# Altium schematic sheet BSPD_System.SchDoc: QUTMS Shutdown V2 - BSPD_System
size A4; Author: Jonn Dillon; Organization: QUT Motorsport; Address1: O-120; Address2: O Block; Address3: QUT Gardens Point; Address4: Brisbane, 4000; DocumentNumber: 9; SheetNumber: 9; SheetTotal: 13
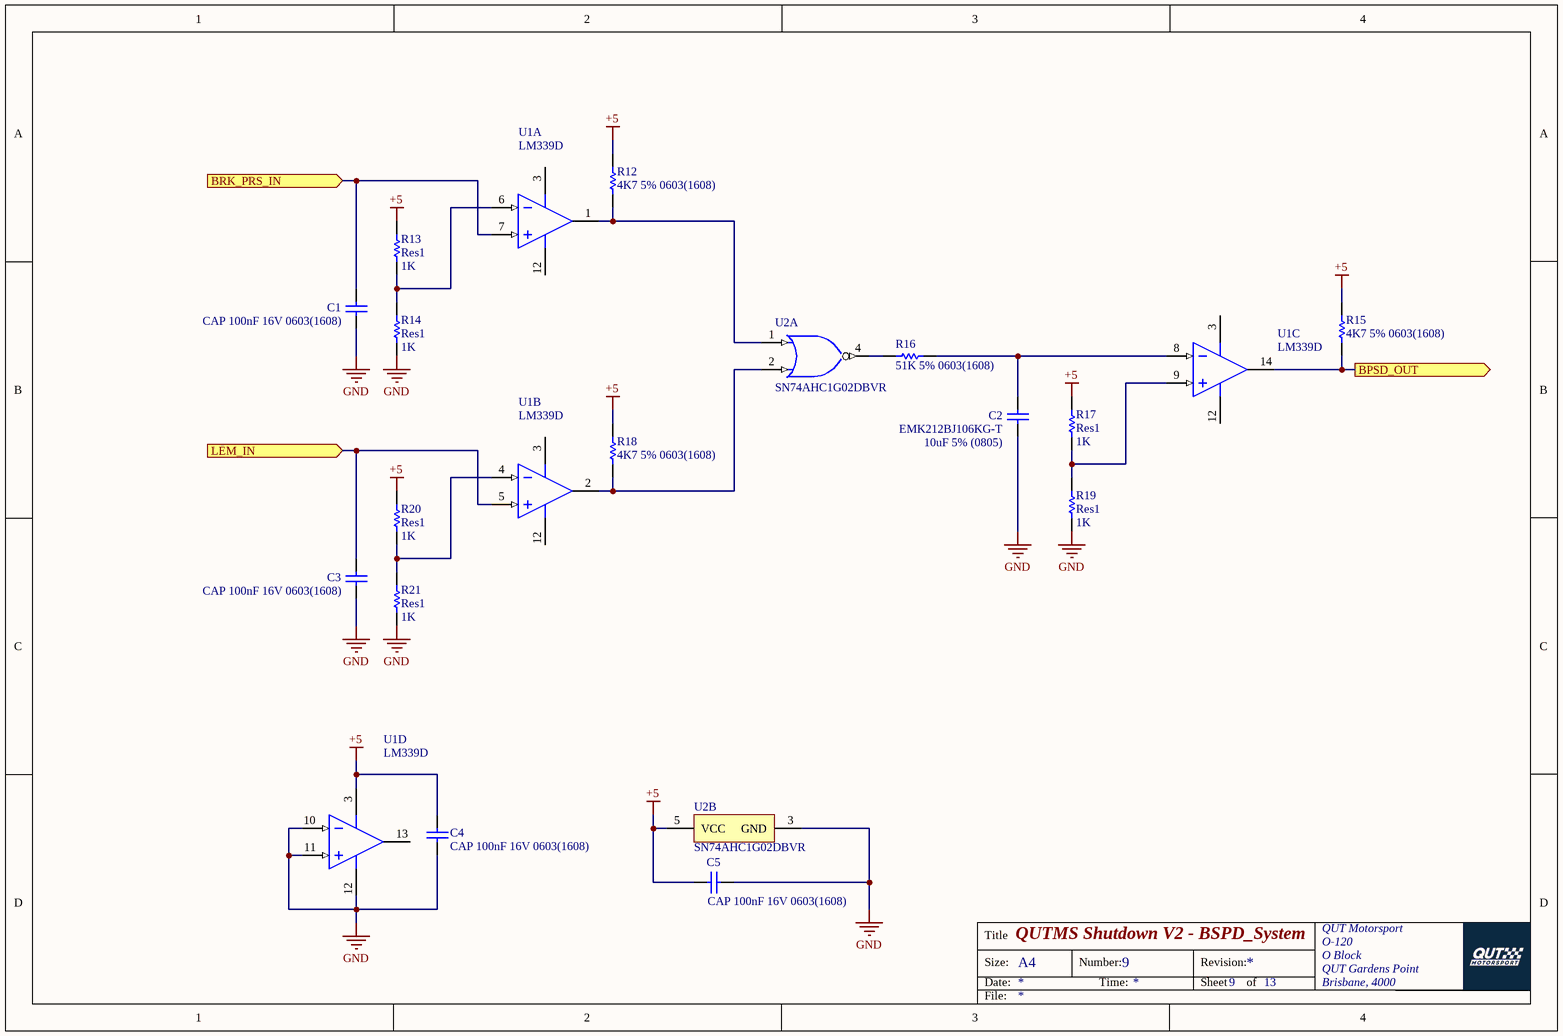
[diagram p0: BSPD_System.SchDoc]

## Parts
C1  CAP 100nF 16V 0603(1608)  [CAPC0603(1608)100_M]
C2  EMK212BJ106KG-T  [CAPC2013X135X50ML10T25]
C3  CAP 100nF 16V 0603(1608)  [CAPC0603(1608)100_M]
C4  CAP 100nF 16V 0603(1608)  [CAPC0603(1608)100_M]
C5  CAP 100nF 16V 0603(1608)  [CAPC0603(1608)100_M]
R12  4K7 5% 0603(1608)  [RESC0603(1608)_N]
R13  Res1  value 1K  [AXIAL-0.3]
R14  Res1  value 1K  [AXIAL-0.3]
R15  4K7 5% 0603(1608)  [RESC0603(1608)_N]
R16  51K 5% 0603(1608)  [RESC0603(1608)_M]
R17  Res1  value 1K  [AXIAL-0.3]
R18  4K7 5% 0603(1608)  [RESC0603(1608)_N]
R19  Res1  value 1K  [AXIAL-0.3]
R20  Res1  value 1K  [AXIAL-0.3]
R21  Res1  value 1K  [AXIAL-0.3]
U1  LM339D  [D0014A_L]  (parts A,B,C,D of 4)
U2  SN74AHC1G02DBVR  [DBV0005A_L]  (parts A,B of 2)

## Ports
BPSD_OUT (out), BRK_PRS_IN (in), LEM_IN (in)

## Nets
+5: C4.2 C5.1 R12.2 R13.1 R15.2 R17.2 R18.2 R20.2 U1.3(VCC) U2.5(VCC)
GND: C1.1 C2.1 C3.1 C4.1 C5.2 R14.2 R19.1 R21.1 U1.10(IN4-) U1.11(IN4+) U1.12(GND) U2.3(GND)
BPSD_OUT: R15.1 U1.14(OUT3) ; port BPSD_OUT
BRK_PRS_IN: C1.2 U1.7(IN1+) ; port BRK_PRS_IN
LEM_IN: C3.2 U1.5(IN2+) ; port LEM_IN
NetC2_2: C2.2 R16.2 U1.8(IN3-)
NetR12_1: R12.1 U1.1(OUT1) U2.1(A)
NetR13_2: R13.2 R14.1 U1.6(IN1-)
NetR16_1: R16.1 U2.4(Y)
NetR17_1: R17.1 R19.2 U1.9(IN3+)
NetR18_1: R18.1 U1.2(OUT2) U2.2(B)
NetR20_1: R20.1 R21.2 U1.4(IN2-)

Not connected (* = marked no-connect by the designer): U1 13(OUT4)

## Notes on the sheet
- (near C2) 10uF 5% (0805)
- Title
- Size:
- Date:
- A4
- Number:
- Time:
- Revision:
- Sheet
- of
- File:

## Library data of the parts
C1 C3-C5 = CMP-1035-02583-1: CAP 100nF 16V ±5% 0603 (1608 Metric) Thickness 1mm SMD; Tolerance: Â±5%; Case-Metric: 1608; Case-EIA: 0603; Rated Voltage: 16 V; Max Thickness: 1 mm; Technology: SMT; Value: 100nF
C2 = CMP-2000-05449-1: Chip Capacitor, 10 uF, +/- 10%, 16 V, -25 to 85 degC, 0805 (2012 Metric), RoHS, Tape and Reel; PCN Part Number: X5R,X7RDielectrics23/Jan/2008; Manufacturer: Taiyo Yuden; Other Names: 587-1295-1; Voltage - Rated: 16V; Catalog Drawings: xMKSeries_0805_1.25; Online Catalog: MSeries; Capacitance: 10µF; Temperature Coefficient: X5R; Kits: 587-1797-KIT-ND-KITCAPCERHICAP0603&0805S; Category: Capacitors; Package Description: 2-Pin Surface Mount Device, Body 2 x 1.25 mm; Datasheet Version: Sep-12; Package / Case: 0805(2012Metric); Tolerance: ±10%; Height - Seated (Max): -; Size / Dimension: 0.079"Lx0.049"W(2.00mmx1.25mm); Lead Style: -; Packaging: CutTape(CT); Datasheet URL: https://datasheet.ciiva.com/26871/getdatasheetpartid-638258-26871376.pdf; Applications: GeneralPurpose; Mounting Type: SurfaceMount,MLCC; Package Reference: 805; Operating Temperature: -55degC~85degC; Thickness (Max): 0.053"(1.35mm); Ratings: -; Features: -; Standard Package: 1; Series: M; Family: CeramicCapacitors; Lead Spacing: -; Manufacturer URL: http://www.t-yuden.com/
R12 R15 R18 = CMP-1012-00090-1: 4K7 0.1W 5% 0603 (1608 Metric)  SMD; Case-Metric: 1608; Value: 4700.00 Ohm; Case-EIA: 0603; Tolerance: 5 %; Technology: SMT; Power: 0.1 W
R13 R14 R17 R19-R21 = Res1: Resistor; Published: 8-Jun-2000; LatestRevisionDate: 17-Jul-2002; LatestRevisionNote: Re-released for DXP Platform.; PackageReference: AXIAL-0.3; Publisher: Altium Limited; PackageDescription: Axial Device, Thru-Hole; 2 Leads; 0.3 in Pin Spacing
R16 = CMP-1012-00115-1: 51K 0.1W 5% 0603 (1608 Metric)  SMD; Case-EIA: 0603; Case-Metric: 1608; Value: 51000.00 Ohm; Power: 0.1 W; Technology: SMT; Tolerance: 5 %
U1 = CMP-2000-06548-1: Quad Differential Comparator, 2 to 30 V, 0 to 70 degC, 14-pin SOIC (D14), Green (RoHS & no Sb/Br), Tube; Manufacturer: Texas Instruments; Response Time: 300ns; No. of Comparators: 4; Package Version: 4040047-5/M, 06/2011; IC Output Type: CMOS,MOS,TTL; No. of Pins: 14Pins; Supply Voltage Range: 2Vto36V,±1Vto±18V; Product Range: -; Mounting Technology: SurfaceMount; Operating Temperature Min: 0°C; Package URL: http://www.ti.com/lit/ml/mpds177g/mpds177g.pdf; Automotive Qualification Standard: -; Package Description: 14-Pin Small Outline Integrated Circuit, Body 8.65 x 3.9 mm, Pitch 1.27 mm; Comparator Type: Differential; Manufacturer URL: http://www.ti.com/; Comparator Case Style: SOIC; Packaging: CutTape; Package Reference: D14; Datasheet URL: http://www.ti.com/general/docs/lit/getliterature.tsp?genericPartNumber=LM339&fileType=pdf; Datasheet Version: Rev. T, 06/2015; Operating Temperature Max: 70°C
U2 = CMP-0859-00024-3: Single 2-Input Positive-NOR Gate, DBV0005A, LARGE T&R; Manufacturer: Texas Instruments; Output Drive (IOL/IOH)(Max)(mA): 50/-50; Sub-Family: NAND Gate; Gate Type: NOR; Output Type: CMOS; 3-State Output: No; Voltage(Nom)(V): 3.3,5; tpd @ Nom Voltage(Max)(ns): 11.4,7.5; Bits(#): 1; VCC(Max)(V): 5.5; ICC @ Nom Voltage(Max)(mA): 0.01; VCC(Min)(V): 2; Technology Family: AHC; Rating: Catalog; Logic: True; F @ Nom Voltage(Max)(Mhz): 75; DatasheetVersion: SCLS342M; Input Type: CMOS; Operating Temperature Range(C): -40 to 125,-40 to 85; Generic Part Number: SN74AHC1G02; PackageReference: DBV0005A; Schmitt Trigger: No